# Altium project DRLGabarit.PrjPCB
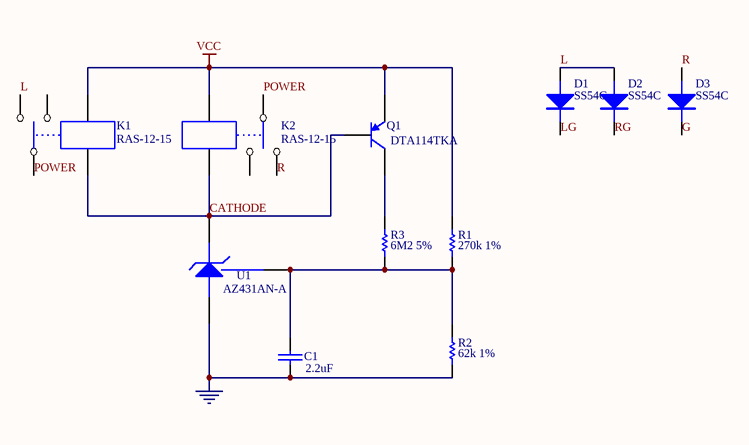
[diagram p0: DRLGabarit.SchDoc]
1 sheet, 11 parts. Net scope: global (net labels, ports and power ports of the same name join across sheets).
Board file: DRLGabarit.PcbDoc

## Sheet DRLGabarit.SchDoc
size A4

### Parts
C1  2.2uF  [0805]
D1  SS54C  [SMC]
D2  SS54C  [SMC]
D3  SS54C  [SMC]
K1  RAS-12-15  [RELAY5PIN]
K2  RAS-12-15  [RELAY5PIN]
Q1  DTA114TKA  [sot-23]
R1  270k 1%  [0805]
R2  62k 1%  [0805]
R3  6M2 5%  [0805]
U1  AZ431AN-A  [SOT-23]

### Nets
PGND: C1.2 R2.2 U1.2(A)
VCC: K1.5 K2.4 Q1.3(E) R1.1
CATHODE: K1.4 K2.5 Q1.1(B) U1.3(K)
G: D3.1(K)
L: D1.2(A) D2.2(A) K1.2
LG: D1.1(K)
POWER: K1.1 K2.1
R: D3.2(A) K2.2
RG: D2.1(K)
NetC1_1: C1.1 R1.2 R2.1 R3.2 U1.1(REF)
NetQ1_2: Q1.2(C) R3.1

Not connected (* = marked no-connect by the designer): K1 3; K2 3

### Library data of the parts
C1 = CAP: Capacitor
D1-D3 = DIODE
K1 K2 = RELAY-SPDT
Q1 = PNP: PNP Bipolar Transistor; Manufacturer: Generic Components; Class: Discrete; SubClass: BJT - Low Power; Published: 08/06/2000; Publisher: Altium Hobart Technology Centre
R1-R3 = Res1: Resistor; Manufacturer: Generic Components; Class: Passive; Value: 4k7; Published: 08/06/2000; Publisher: Altium Hobart Technology Centre; SubClass: Resistor
U1 = TL431